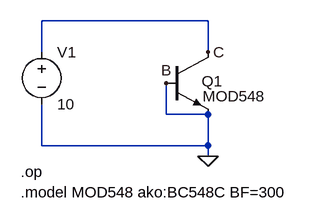
[diagram p0: schematic Circuito1.asc]
Circuito1.asc, the LTspice schematic file:
Version 4
SHEET 1 5124 680
WIRE 192 64 -64 64
WIRE -64 112 -64 64
WIRE 192 112 192 64
WIRE 128 208 128 160
WIRE 192 208 128 208
WIRE -64 256 -64 192
WIRE 192 256 192 208
WIRE 192 256 -64 256
WIRE 192 272 192 256
FLAG 192 272 0
FLAG 192 112 C
FLAG 128 160 B
DATAFLAG 128 208 ""
DATAFLAG 192 64 "Ic(Q1)"
SYMBOL npn 128 112 R0
WINDOW 0 54 45 Left 2
SYMATTR InstName Q1
SYMATTR Value MOD548
SYMBOL voltage -64 96 R0
SYMATTR InstName V1
SYMATTR Value 10
TEXT -96 296 Left 2 !.op
TEXT -96 328 Left 2 !.model MOD548 ako:BC548C BF=300

The netlist it stands for:
* Circuito1.asc
Q1 C 0 0 0 MOD548
V1 C 0 10
.model NPN NPN
.model PNP PNP
.lib standard.bjt
.op
.model MOD548 ako:BC548C BF=300
.backanno
.end

* Results of the author's LTspice run, read from the files saved beside the schematic
* Operating Point:
*   V(c) = 10 V
*   Ic(Q1) = 10.13 pA
*   Ib(Q1) = -10.11 pA
*   Ie(Q1) = -21.63 fA
*   I(V1) = -10.13 pA
* From the log:
*   Semiconductor Device Operating Points:
*                           --- Bipolar Transistors ---
*   Name:       q1
*   Model:    mod548
*   Ib:      -1.01e-11
*   Ic:       1.01e-11
*   Vbe:      0.00e+00
*   Vbc:     -1.00e+01
*   Vce:      1.00e+01
*   BetaDC:  -1.00e+00
*   Gm:       8.41e-13
*   Rpi:      9.61e+11
*   Rx:       2.65e+01
*   Ro:       4.70e+15
*   Cbe:      1.33e-11
*   Cbc:      1.74e-12
*   Cjs:      0.00e+00
*   BetaAC:   8.08e-01
*   Cbx:      0.00e+00
*   Ft:       6.49e-03